# Altium schematic sheet SSD_PINOUT.SchDoc
size A4; SheetNumber: 6; SheetTotal: 8
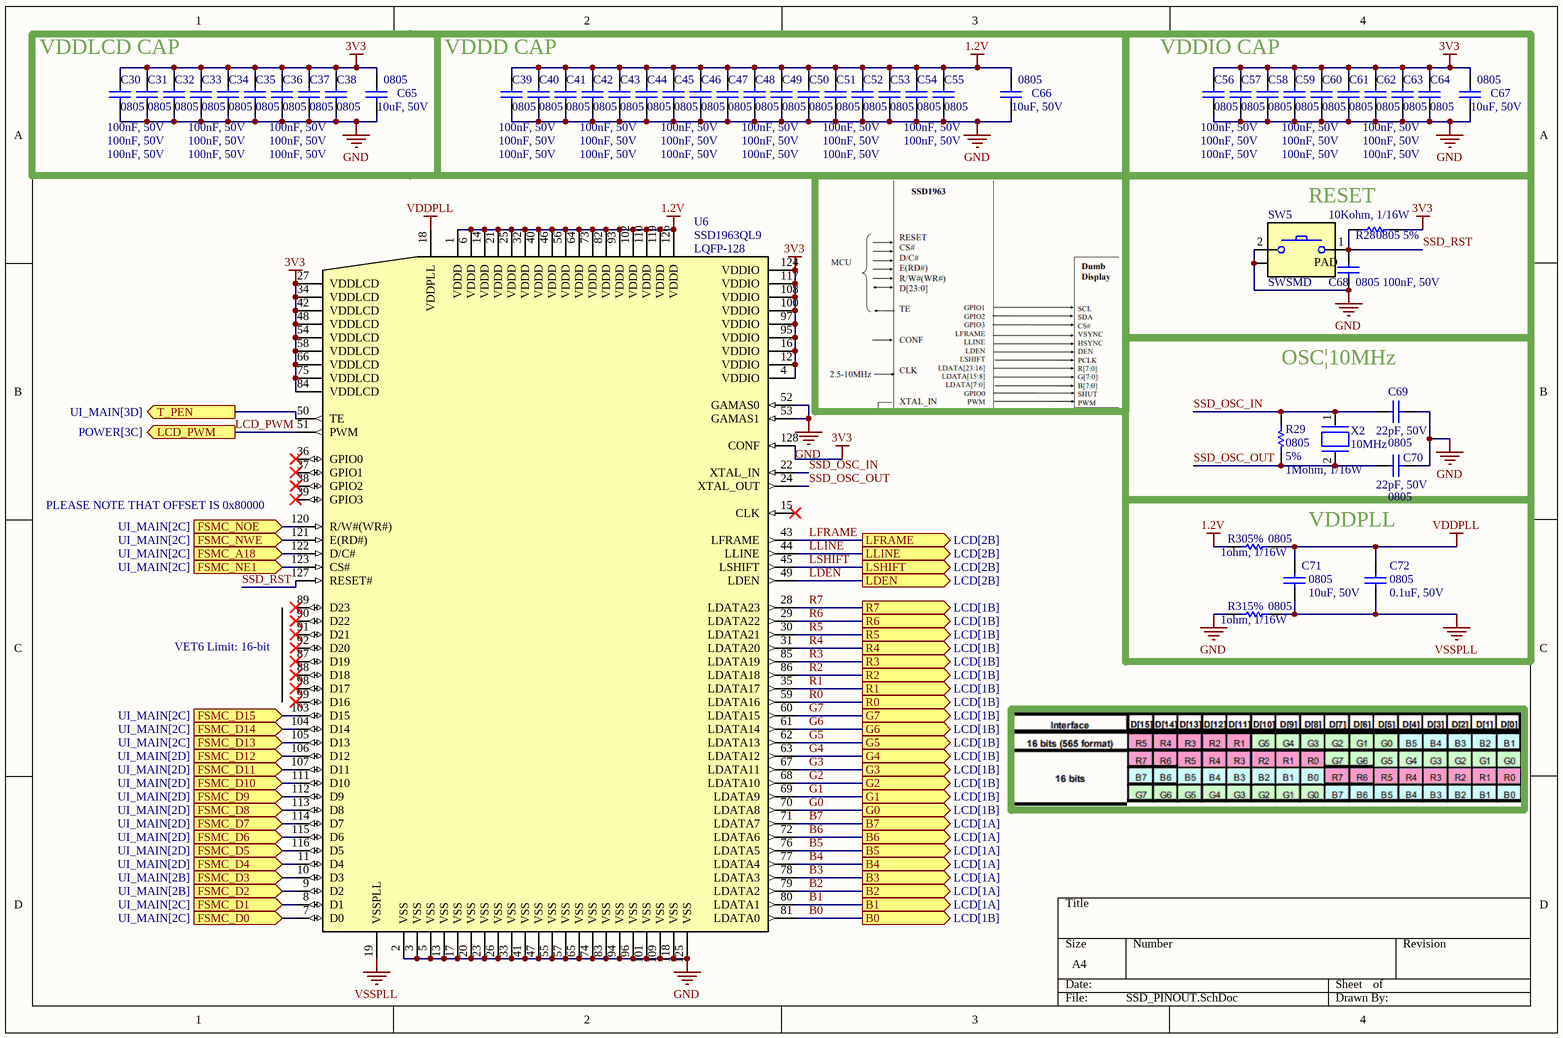
[diagram p0: SSD_PINOUT.SchDoc]

## Parts
C30  Package: 0805  [C_0805]  (hidden comment: 100nF, 50V)
C31  Package: 0805  [C_0805]  (hidden comment: 100nF, 50V)
C32  Package: 0805  [C_0805]  (hidden comment: 100nF, 50V)
C33  Package: 0805  [C_0805]  (hidden comment: 100nF, 50V)
C34  Package: 0805  [C_0805]  (hidden comment: 100nF, 50V)
C35  Package: 0805  [C_0805]  (hidden comment: 100nF, 50V)
C36  Package: 0805  [C_0805]  (hidden comment: 100nF, 50V)
C37  Package: 0805  [C_0805]  (hidden comment: 100nF, 50V)
C38  Package: 0805  [C_0805]  (hidden comment: 100nF, 50V)
C39  Package: 0805  [C_0805]  (hidden comment: 100nF, 50V)
C40  Package: 0805  [C_0805]  (hidden comment: 100nF, 50V)
C41  Package: 0805  [C_0805]  (hidden comment: 100nF, 50V)
C42  Package: 0805  [C_0805]  (hidden comment: 100nF, 50V)
C43  Package: 0805  [C_0805]  (hidden comment: 100nF, 50V)
C44  Package: 0805  [C_0805]  (hidden comment: 100nF, 50V)
C45  Package: 0805  [C_0805]  (hidden comment: 100nF, 50V)
C46  Package: 0805  [C_0805]  (hidden comment: 100nF, 50V)
C47  Package: 0805  [C_0805]  (hidden comment: 100nF, 50V)
C48  Package: 0805  [C_0805]  (hidden comment: 100nF, 50V)
C49  Package: 0805  [C_0805]  (hidden comment: 100nF, 50V)
C50  Package: 0805  [C_0805]  (hidden comment: 100nF, 50V)
C51  Package: 0805  [C_0805]  (hidden comment: 100nF, 50V)
C52  Package: 0805  [C_0805]  (hidden comment: 100nF, 50V)
C53  Package: 0805  [C_0805]  (hidden comment: 100nF, 50V)
C54  Package: 0805  [C_0805]  (hidden comment: 100nF, 50V)
C55  Package: 0805  [C_0805]  (hidden comment: 100nF, 50V)
C56  Package: 0805  [C_0805]  (hidden comment: 100nF, 50V)
C57  Package: 0805  [C_0805]  (hidden comment: 100nF, 50V)
C58  Package: 0805  [C_0805]  (hidden comment: 100nF, 50V)
C59  Package: 0805  [C_0805]  (hidden comment: 100nF, 50V)
C60  Package: 0805  [C_0805]  (hidden comment: 100nF, 50V)
C61  Package: 0805  [C_0805]  (hidden comment: 100nF, 50V)
C62  Package: 0805  [C_0805]  (hidden comment: 100nF, 50V)
C63  Package: 0805  [C_0805]  (hidden comment: 100nF, 50V)
C64  Package: 0805  [C_0805]  (hidden comment: 100nF, 50V)
C65  Package: 0805  [C_0805]  (hidden comment: 10uF, 50V)
C66  Package: 0805  [C_0805]  (hidden comment: 10uF, 50V)
C67  Package: 0805  [C_0805]  (hidden comment: 10uF, 50V)
C68  Package: 0805  [C_0805]  (hidden comment: 100nF, 50V)
C69  Package: 0805  [C_0805]  (hidden comment: 22pF, 50V)
C70  Package: 0805  [C_0805]  (hidden comment: 22pF, 50V)
C71  Package: 0805  [C_0805]  (hidden comment: 10uF, 50V)
C72  Package: 0805  [C_0805]  (hidden comment: 0.1uF, 50V)
R28  Package: 0805  Acc: 5%  [R_0805]  (hidden comment: 10Kohm, 1/16W)
R29  Package: 0805  Acc: 5%  [R_0805]  (hidden comment: 1Mohm, 1/16W)
R30  Package: 0805  Acc: 5%  [R_0805]  (hidden comment: 1ohm, 1/16W)
R31  Package: 0805  Acc: 5%  [R_0805]  (hidden comment: 1ohm, 1/16W)
SW5  SWSMD  [SW_SMD]
U6  SSD1963QL9  Package: LQFP-128  [PKG_LQFP-128]
X2  10MHz  [PKG_HC49-S]

## Blocks framed on the sheet
VDDLCD CAP: C30-C38 C65
VDDIO CAP: C56-C64 C67
RESET: C68 R28 SW5
OSC|10MHz: C69 C70 R29 X2
VDDPLL: C71 C72 R30 R31

## Ports
B0 (out, see LCD[1B]), B1 (out, see LCD[1A]), B2 (out, see LCD[1A]), B3 (out, see LCD[1A]), B4 (out, see LCD[1A]), B5 (out, see LCD[1A]), B6 (out, see LCD[1A]), B7 (out, see LCD[1A]), FSMC_A18 (in, see UI_MAIN[2C]), FSMC_D0 (in, see UI_MAIN[2C]), FSMC_D1 (in, see UI_MAIN[2C]), FSMC_D2 (in, see UI_MAIN[2B]), FSMC_D3 (in, see UI_MAIN[2B]), FSMC_D4 (in, see UI_MAIN[2D]), FSMC_D5 (in, see UI_MAIN[2D]), FSMC_D6 (in, see UI_MAIN[2D]), FSMC_D7 (in, see UI_MAIN[2D]), FSMC_D8 (in, see UI_MAIN[2D]), FSMC_D9 (in, see UI_MAIN[2D]), FSMC_D10 (in, see UI_MAIN[2D]), FSMC_D11 (in, see UI_MAIN[2D]), FSMC_D12 (in, see UI_MAIN[2D]), FSMC_D13 (in, see UI_MAIN[2C]), FSMC_D14 (in, see UI_MAIN[2C]), FSMC_D15 (in, see UI_MAIN[2C]), FSMC_NE1 (in, see UI_MAIN[2C]), FSMC_NOE (in, see UI_MAIN[2C]), FSMC_NWE (in, see UI_MAIN[2C]), G0 (out, see LCD[1B]), G1 (out, see LCD[1B]), G2 (out, see LCD[1B]), G3 (out, see LCD[1B]), G4 (out, see LCD[1B]), G5 (out, see LCD[1B]), G6 (out, see LCD[1B]), G7 (out, see LCD[1B]), LCD_PWM (out, see POWER[3C]), LDEN (out, see LCD[2B]), LFRAME (out, see LCD[2B]), LLINE (out, see LCD[2B]), LSHIFT (out, see LCD[2B]), R0 (out, see LCD[1B]), R1 (out, see LCD[1B]), R2 (out, see LCD[1B]), R3 (out, see LCD[1B]), R4 (out, see LCD[1B]), R5 (out, see LCD[1B]), R6 (out, see LCD[1B]), R7 (out, see LCD[1B]), T_PEN (out, see UI_MAIN[3D])

## Nets
1.2V: C39.2 C40.2 C41.2 C42.2 C43.2 C44.2 C45.2 C46.2 C47.2 C48.2 C49.2 C50.2 C51.2 C52.2 C53.2 C54.2 C55.2 C66.2 R30.2 U6.1(VDDD) U6.6(VDDD) U6.14(VDDD) U6.21(VDDD) U6.25(VDDD) U6.32(VDDD) U6.40(VDDD) U6.46(VDDD) U6.56(VDDD) U6.64(VDDD) U6.73(VDDD) U6.82(VDDD) U6.93(VDDD) U6.102(VDDD) U6.110(VDDD) U6.119(VDDD) U6.126(VDDD)
3V3: C30.2 C31.2 C32.2 C33.2 C34.2 C35.2 C36.2 C37.2 C38.2 C56.2 C57.2 C58.2 C59.2 C60.2 C61.2 C62.2 C63.2 C64.2 C65.2 C67.2 R28.1 U6.4(VDDIO) U6.12(VDDIO) U6.16(VDDIO) U6.27(VDDLCD) U6.34(VDDLCD) U6.42(VDDLCD) U6.48(VDDLCD) U6.54(VDDLCD) U6.58(VDDLCD) U6.66(VDDLCD) U6.75(VDDLCD) U6.84(VDDLCD) U6.95(VDDIO) U6.97(VDDIO) U6.100(VDDIO) U6.108(VDDIO) U6.117(VDDIO) U6.124(VDDIO) U6.128(CONF)
GND: C30.1 C31.1 C32.1 C33.1 C34.1 C35.1 C36.1 C37.1 C38.1 C39.1 C40.1 C41.1 C42.1 C43.1 C44.1 C45.1 C46.1 C47.1 C48.1 C49.1 C50.1 C51.1 C52.1 C53.1 C54.1 C55.1 C56.1 C57.1 C58.1 C59.1 C60.1 C61.1 C62.1 C63.1 C64.1 C65.1 C66.1 C67.1 C68.1 C69.1 C70.1 R31.2 SW5.0(PAD) SW5.2 U6.2(VSS) U6.3(VSS) U6.5(VSS) U6.13(VSS) U6.17(VSS) U6.20(VSS) U6.23(VSS) U6.26(VSS) U6.33(VSS) U6.41(VSS) U6.47(VSS) U6.52(GAMAS0) U6.53(GAMAS1) U6.55(VSS) U6.57(VSS) U6.65(VSS) U6.74(VSS) U6.83(VSS) U6.94(VSS) U6.96(VSS) U6.101(VSS) U6.109(VSS) U6.118(VSS) U6.125(VSS)
VDDPLL: C71.2 C72.2 R30.1 U6.18(VDDPLL)
VSSPLL: C71.1 C72.1 R31.1 U6.19(VSSPLL)
B0: U6.81(LDATA0) ; port B0
B1: U6.80(LDATA1) ; port B1
B2: U6.79(LDATA2) ; port B2
B3: U6.78(LDATA3) ; port B3
B4: U6.77(LDATA4) ; port B4
B5: U6.76(LDATA5) ; port B5
B6: U6.72(LDATA6) ; port B6
B7: U6.71(LDATA7) ; port B7
FSMC_A18: U6.122(D/C#) ; port FSMC_A18
FSMC_D0: U6.7(D0) ; port FSMC_D0
FSMC_D1: U6.8(D1) ; port FSMC_D1
FSMC_D2: U6.9(D2) ; port FSMC_D2
FSMC_D3: U6.10(D3) ; port FSMC_D3
FSMC_D4: U6.11(D4) ; port FSMC_D4
FSMC_D5: U6.116(D5) ; port FSMC_D5
FSMC_D6: U6.115(D6) ; port FSMC_D6
FSMC_D7: U6.114(D7) ; port FSMC_D7
FSMC_D8: U6.113(D8) ; port FSMC_D8
FSMC_D9: U6.112(D9) ; port FSMC_D9
FSMC_D10: U6.111(D10) ; port FSMC_D10
FSMC_D11: U6.107(D11) ; port FSMC_D11
FSMC_D12: U6.106(D12) ; port FSMC_D12
FSMC_D13: U6.105(D13) ; port FSMC_D13
FSMC_D14: U6.104(D14) ; port FSMC_D14
FSMC_D15: U6.103(D15) ; port FSMC_D15
FSMC_NE1: U6.123(CS#) ; port FSMC_NE1
FSMC_NOE: U6.120(R/W#(WR#)) ; port FSMC_NOE
FSMC_NWE: U6.121(E(RD#)) ; port FSMC_NWE
G0: U6.70(LDATA8) ; port G0
G1: U6.69(LDATA9) ; port G1
G2: U6.68(LDATA10) ; port G2
G3: U6.67(LDATA11) ; port G3
G4: U6.63(LDATA12) ; port G4
G5: U6.62(LDATA13) ; port G5
G6: U6.61(LDATA14) ; port G6
G7: U6.60(LDATA15) ; port G7
LCD_PWM: U6.51(PWM) ; port LCD_PWM
LDEN: U6.49(LDEN) ; port LDEN
LFRAME: U6.43(LFRAME) ; port LFRAME
LLINE: U6.44(LLINE) ; port LLINE
LSHIFT: U6.45(LSHIFT) ; port LSHIFT
R0: U6.59(LDATA16) ; port R0
R1: U6.35(LDATA17) ; port R1
R2: U6.86(LDATA18) ; port R2
R3: U6.85(LDATA19) ; port R3
R4: U6.31(LDATA20) ; port R4
R5: U6.30(LDATA21) ; port R5
R6: U6.29(LDATA22) ; port R6
R7: U6.28(LDATA23) ; port R7
SSD_OSC_IN: C69.2 R29.1 U6.22(XTAL_IN) X2.1
SSD_OSC_OUT: C70.2 R29.2 U6.24(XTAL_OUT) X2.2
SSD_RST: C68.2 R28.2 SW5.1 U6.127(RESET#)
T_PEN: U6.50(TE) ; port T_PEN

Not connected (* = marked no-connect by the designer): U6 15(CLK)* 36(GPIO0)* 37(GPIO1)* 38(GPIO2)* 39(GPIO3)* 87(D19)* 88(D18)* 89(D23)* 90(D22)* 91(D21)* 92(D20)* 98(D17)* 99(D16)*

## Notes on the sheet
- VDDD CAP
- PLEASE NOTE THAT OFFSET IS 0x80000
- (near U6) VET6 Limit: 16-bit

## Library data of the parts
C30-C72 = CAP_0805: Manufacturer 1: Vishay; Manufacturer Part Number 1: CAP0805; Supplier 1: Thegioiic; Datasheet: https://www.mouser.de/datasheet/2/447/PYu_RC_Group_51_RoHS_L_11-1984063.pdf; Supplier Link: N/a
  C30-C64 C68: Value: 100nF, 50V
  C65-C67 C71: Value: 10uF, 50V
  C69 C70: Value: 22pF, 50V
  C72: Value: 0.1uF, 50V
R28-R31 = RES_0805: Manufacturer 1: Vishay; Manufacturer Part Number 1: RES0805; Supplier 1: Thegioiic; Datasheet: https://www.mouser.de/datasheet/2/447/PYu_RC_Group_51_RoHS_L_11-1984063.pdf; Supplier Link: N/a
  R28: Value: 10Kohm, 1/16W
  R29: Value: 1Mohm, 1/16W
  R30 R31: Value: 1ohm, 1/16W
SW5 = SWSMD: SW_SMD; Manufacturer 1: OEM; Manufacturer Part Number 1: N/a; Supplier 1: Thegioiic; Datasheet: N/a; Supplier Link: https://www.thegioiic.com/nut-nhan-3x6mm-cao-3-5mm-4-chan-smd-chinh-ngang
U6 = SSD1963QL9: 1215KB Embedded Display SRAM / LCD Display Controller; Manufacturer 1: SOLOMON SYSTECH; Manufacturer Part Number 1: SOLOMON SYSTECH; Supplier 1: TechPal; Datasheet: https://static6.arrow.com/aropdfconversion/7fb71007d6edcf4fd7d2515afdb6bb091bd21e01/ssd1963ql9.pdf; Supplier Link: https://linhkien.techpal.vn/san-pham/ssd1963ql9/
X2 = XTAL_8MHZ: Crystal, 10 MHz, -30 to 85 degC, 3.2 x 2.5 x 0.9 mm SMD; Manufacturer 1: OEM; Manufacturer Part Number 1: SMD HC49-S 10MHz; Supplier 1: Thegioiic; Datasheet: N/a; Supplier Link: https://www.thegioiic.com/thach-anh-10mhz-2-chan-smd-hc49-s